# EAGLE board e-ink-display-v020 (EAGLE 7.3.0)
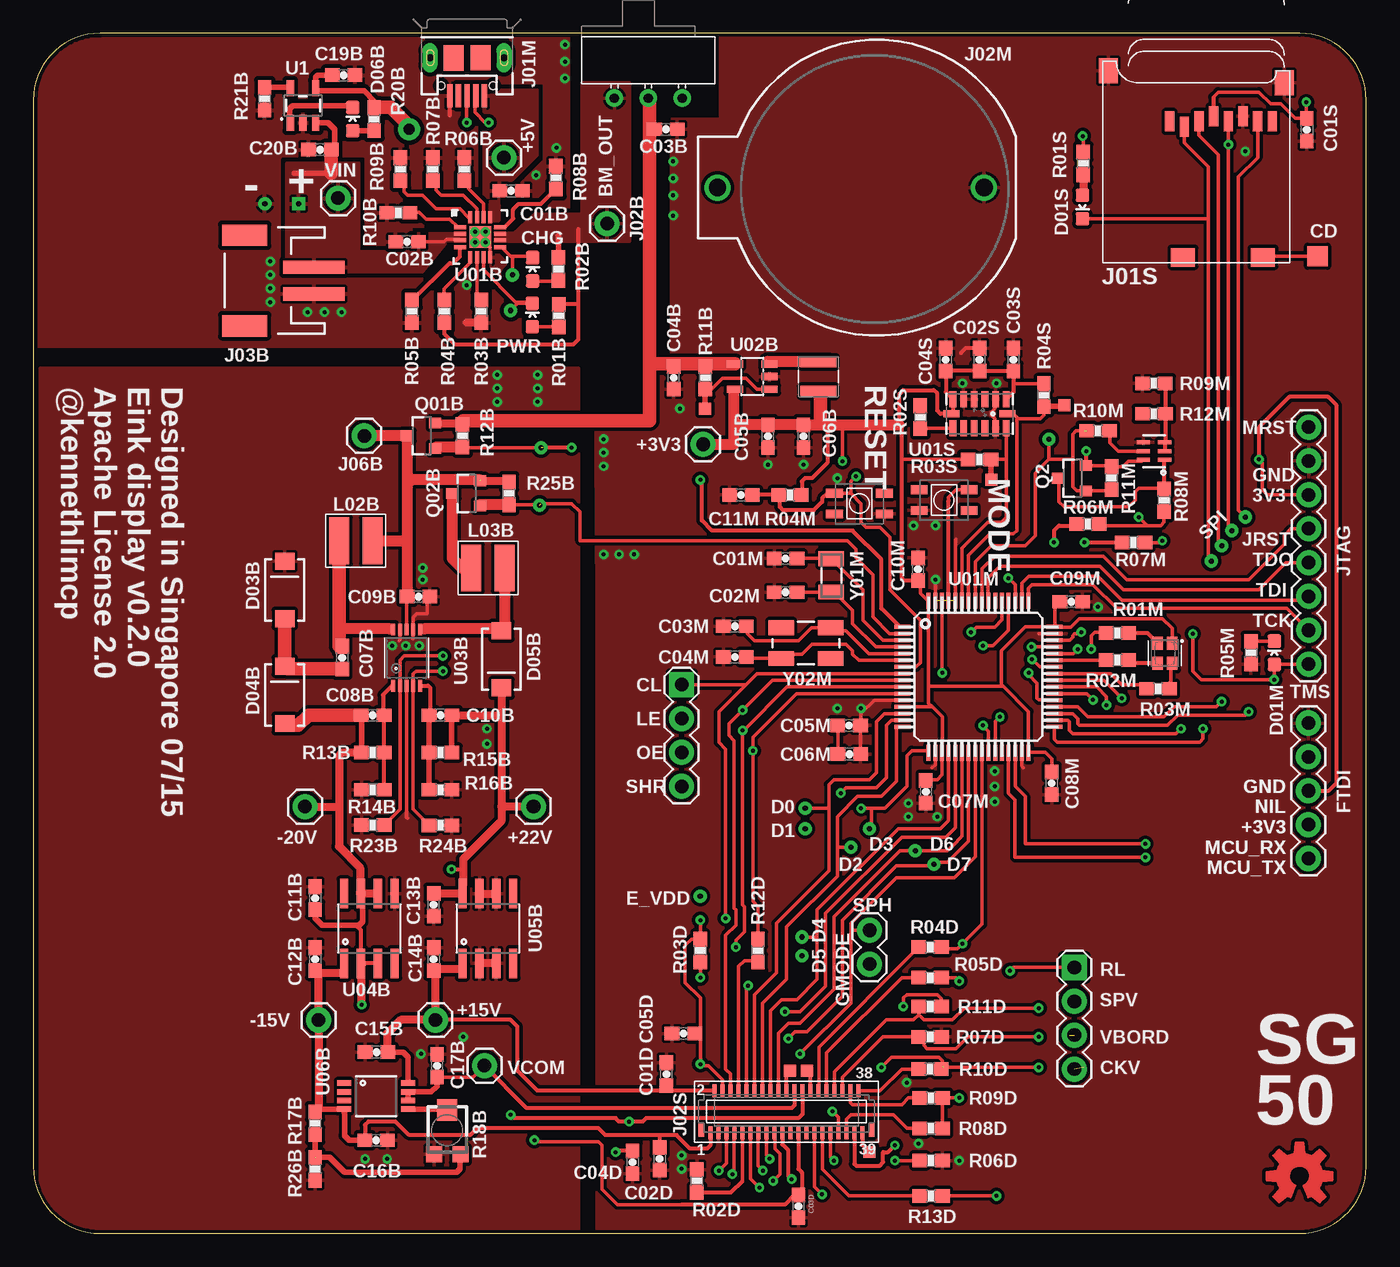
[diagram p4: board, top side]
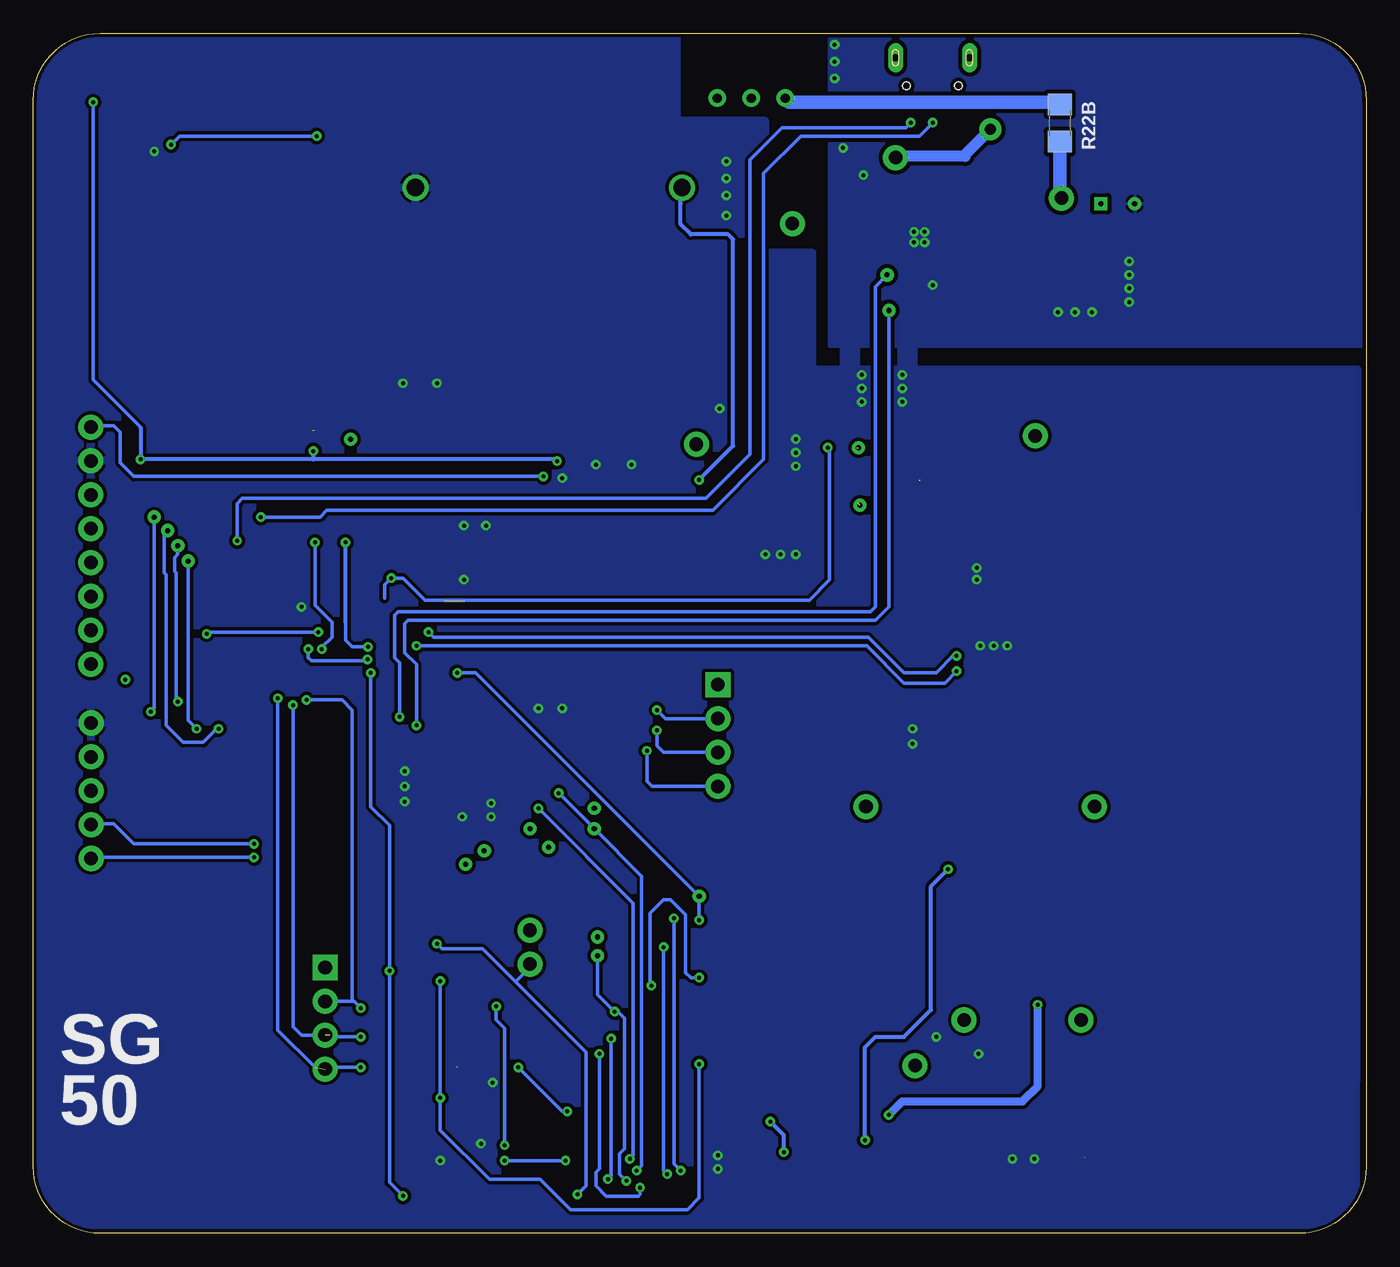
[diagram p5: board, bottom side, seen from below]

Size 100 x 90 mm. Coordinates in mm from the lower left corner, seen from the top.
Outline: 5,0 95,0 arc90 100,5 100,85 arc90 95,90 5,90 arc90 0,85 0,5 arc90 5,0
Copper layers (1+2*15+16): Top 0.018mm / dielectric 0.195mm / Route2 0.035mm / dielectric 1.1mm / Route15 0.035mm / dielectric 0.195mm / Bottom 0.018mm
Design rules "spark-4layer": minimum track width 6mil, minimum drill 0.3mm, track to track 6mil, track to pad 6mil, pad to pad 6mil, via to via 6mil, smd to smd 6mil, copper to edge 6mil, drill to drill 6mil, minimum pad ring 12mil, minimum via ring 8mil, stop-mask expansion 4mil, vias tented up to drill 20mil, thermal gap 8mil
Net classes: 0 default: clearance 0.205 mm

## Footprints (pad centres in the part's own frame; a part is rotated, then mirrored left to right if it is on the bottom)
TP-SQ_15TH = drill 0.381 pad 0.61 square: P$1 0,0
TP-RD_15TH = drill 0.381 pad 0.61: P$1 0,0
0603-CAP = smd 1.1 x 1: 1 -0.85,0; 2 0.85,0
LED-0603 = smd 1 x 1: A 0,-0.877; C 0,0.877
PLCC4-2MM-RGB = smd 1 x 0.8: BLUE -0.75,-0.55; CA 0.75,-0.55; GREEN -0.75,0.55; RED 0.75,0.55
SMA-DIODE = smd 1.27 x 1.47: A -2.15,0; C 2.15,0
1X01 = drill 1.016 pad 1.88: 1 0,0
USB-MICROB-SLOT-HOLE-EXTEND = smd 0.4 x 1.7: D+ 0,2.85; D- -0.65,2.85; GND 1.3,2.85; ID 0.65,2.85; VBUS -1.3,2.85 | drill 0.5 pad 1.1 long: MT1 -2.775,0; MT2 2.775,0 | smd 1.5 x 1.9: P$1 -1,0; P$2 1,0.01 | hole 0.6: -1.95,2.1; 1.95,2.1
MICROSD = smd 0.7 x 1.5: 1 9,-10.64; 2 7.9,-10.24; 3 6.8,-10.64; 4 5.7,-11.04; 5 4.6,-10.64; 6 3.5,-11.04; 7 2.4,-10.64; 8 1.3,-10.64 | smd 1.8 x 1.4: CD1 2,-0.44; CD2 8,-0.44 | smd 1.4 x 1.9: MT1 0.4,-13.54; MT2 13.6,-14.44
BATTCOM_20MM_PTH = drill 1.3: 1 11.85,0; 2 -8.15,0
FPC-0.3-39 = smd 0.3 x 1: 1 -1.2,-1.45; 2 -0.89,1.7; 3 -0.6,-1.45; 4 -0.29,1.7; 5 0,-1.45; 6 0.31,1.7; 7 0.6,-1.45; 8 0.91,1.7; 9 1.2,-1.45; 10 1.51,1.7; 11 1.8,-1.45; 12 2.11,1.7; 13 2.4,-1.45; 14 2.71,1.7; 15 3,-1.45; 16 3.31,1.7; 17 3.6,-1.45; 18 3.91,1.7; 19 4.2,-1.45; 20 4.51,1.7; 21 4.8,-1.45; 22 5.11,1.7; 23 5.4,-1.45; 24 5.71,1.7; 25 6,-1.45; 26 6.31,1.7; 27 6.6,-1.45; 28 6.91,1.7; 29 7.2,-1.45; 30 7.51,1.7; 31 7.8,-1.45; 32 8.11,1.7; 33 8.4,-1.45; 34 8.71,1.7; 35 9,-1.45; 36 9.31,1.7; 37 9.6,-1.45; 38 9.91,1.7; 39 10.2,-1.45 | smd 0.4 x 1: H1 -1.9,-1.25; H2 10.9,-1.25
JST-2-SMD = smd 1 x 4.6: 1 -1,-3.7; 2 1,-3.7 | smd 1.6 x 3.4: NC1 -3.4,1.5; NC2 3.4,1.5
1X08_ROUND = drill 1.016 pad 1.88: 1 0,0; 2 2.54,0; 3 5.08,0; 4 7.62,0; 5 10.16,0; 6 12.7,0; 7 15.24,0; 8 17.78,0
1X05 = drill 1.016 pad 1.88: 1 0,0; 2 2.54,0; 3 5.08,0; 4 7.62,0; 5 10.16,0
1X04 = drill 1.016 pad 1.88 square: 1 0,0 | drill 1.016 pad 1.88: 2 2.54,0; 3 5.08,0; 4 7.62,0
1X02 = drill 1.016 pad 1.88: 1 0,0; 2 2.54,0
INDUCTOR-NR3015 = smd 0.8 x 2.7: 1 -1.1,0; 2 1.1,0
4040(1515) = smd 1.5 x 3.5: P$1 1.25,0; P$2 -1.25,0
SOT23-3 = smd 0.8 x 0.9: 1 -0.95,-1; 2 0.95,-1; 3 0,1.1
SOT363 = smd 0.3 x 0.99: 1 -0.65,-0.8; 2 0,-0.8; 3 0.65,-0.8; 4 0.65,0.81; 5 0,0.81; 6 -0.65,0.81
0603-RES = smd 1.1 x 1: 1 -0.85,0; 2 0.85,0
TC33X = smd 1.2 x 1.2: 1 -1,-1.825; 3 1,-1.825 | smd 1.5 x 1.6: 2 0,1.5
1206 = smd 1.6 x 1.8: 1 -1.4,0; 2 1.4,0
TACTILE_SWITCH_SMD = smd 1.25 x 0.65: 1 -1.875,0.775; 2 1.875,0.775; 3 -1.875,-0.775; 4 1.875,-0.775
SW-SPDT-TH = drill 0.7: 1 0,0; 2 -2.54,0; 3 2.54,0
TP35_BOT = smd 0.889 x 0.889 bottom: P$1 0,0
TP_15TH = drill 0.381 pad 0.61: P$1 0,0
SOT23-5 = smd 0.55 x 1.2: 1 -0.95,-1.3; 2 0,-1.3; 3 0.95,-1.3; 4 0.95,1.3; 5 -0.95,1.3
PVQFN-16 = smd 0.9 x 0.3: 1 -1.5,0.75; 2 -1.5,0.25; 3 -1.5,-0.25; 4 -1.5,-0.75; 9 1.5,-0.75; 10 1.5,-0.25; 11 1.5,0.25; 12 1.5,0.75 | smd 0.3 x 0.9: 5 -0.75,-1.5; 6 -0.25,-1.5; 7 0.25,-1.5; 8 0.75,-1.5; 13 0.75,1.5; 14 0.25,1.5; 15 -0.25,1.5; 16 -0.75,1.5 | smd 1.6 x 1.6: EXP 0,0
TQFP64 = smd 1.2 x 0.3: 1 -5.7,3.75; 2 -5.7,3.25; 3 -5.7,2.75; 4 -5.7,2.25; 5 -5.7,1.75; 6 -5.7,1.25; 7 -5.7,0.75; 8 -5.7,0.25; 9 -5.7,-0.25; 10 -5.7,-0.75; 11 -5.7,-1.25; 12 -5.7,-1.75; 13 -5.7,-2.25; 14 -5.7,-2.75; 15 -5.7,-3.25; 16 -5.7,-3.75; 33 5.7,-3.75; 34 5.7,-3.25; 35 5.7,-2.75; 36 5.7,-2.25; 37 5.7,-1.75; 38 5.7,-1.25; 39 5.7,-0.75; 40 5.7,-0.25; 41 5.7,0.25; 42 5.7,0.75; 43 5.7,1.25; 44 5.7,1.75; 45 5.7,2.25; 46 5.7,2.75; 47 5.7,3.25; 48 5.7,3.75 | smd 0.3 x 1.2: 17 -3.75,-5.7; 18 -3.25,-5.7; 19 -2.75,-5.7; 20 -2.25,-5.7; 21 -1.75,-5.7; 22 -1.25,-5.7; 23 -0.75,-5.7; 24 -0.25,-5.7; 25 0.25,-5.7; 26 0.75,-5.7; 27 1.25,-5.7; 28 1.75,-5.7; 29 2.25,-5.7; 30 2.75,-5.7; 31 3.25,-5.7; 32 3.75,-5.7; 49 3.75,5.7; 50 3.25,5.7; 51 2.75,5.7; 52 2.25,5.7; 53 1.75,5.7; 54 1.25,5.7; 55 0.75,5.7; 56 0.25,5.7; 57 -0.25,5.7; 58 -0.75,5.7; 59 -1.25,5.7; 60 -1.75,5.7; 61 -2.25,5.7; 62 -2.75,5.7; 63 -3.25,5.7; 64 -3.75,5.7
LGA14 = smd 0.5 x 1.2: 1 2,1.1; 2 1.2,1.1; 3 0.4,1.1; 4 -0.4,1.1; 5 -1.2,1.1; 6 -2,1.1; 8 -2,-1.1; 9 -1.2,-1.1; 10 -0.4,-1.1; 11 0.4,-1.1; 12 1.2,-1.1; 13 2,-1.1 | smd 1.2 x 0.5: 7 -2.1,0; 14 2.1,0
MSOP-10 = smd 0.305 x 0.889: 1 -1,-2.11; 2 -0.5,-2.11; 3 0,-2.11; 4 0.5,-2.11; 5 1,-2.11; 6 1,2.11; 7 0.5,2.11; 8 0,2.11; 9 -0.5,2.11; 10 -1,2.11
SO08 = smd 0.61 x 2.21: 1 -1.905,-2.616; 2 -0.635,-2.616; 3 0.635,-2.616; 4 1.905,-2.616; 5 1.905,2.616; 6 0.635,2.616; 7 -0.635,2.616; 8 -1.905,2.616
MSOP-8 = smd 0.41 x 1.02: 1 -0.975,-2.4; 2 -0.325,-2.4; 3 0.325,-2.4; 4 0.975,-2.4; 5 0.975,2.4; 6 0.325,2.4; 7 -0.325,2.4; 8 -0.975,2.4
TP60_BOT = smd 1.524 x 1.524 bottom: P$1 0,0
FC135 = smd 1.1 x 1.9: X1 -1.25,0; X2 1.25,0
CRYSTAL-SMD-5X3 = smd 1.9 x 1.1: 1 -1.85,-1.15; 2 1.85,-1.15; 3 1.85,1.15; 4 -1.85,1.15

## Placement (x,y rotation side)
BAT+  [TP-SQ_15TH]  19.91,77.22 0 top
BAT-  [TP-RD_15TH]  17.37,77.22 0 top
C01B  1uF, 25V, 10%  [0603-CAP]  35.84,78.19 180 top
C01D  100nF  [0603-CAP]  47.5,11.94 90 top
C01M  10pF, 6.3V, X5R  [0603-CAP]  56.44,50.62 180 top
C01S  0.1uF, 6.3V, X5R  [0603-CAP]  95.54,82.76 270 top
C02B  4.7uF, 25V, X5R  [0603-CAP]  28.04,74.37 0 top
C02D  100nF  [0603-CAP]  46.99,5.59 270 top
C02M  10pF, 6.3V, X5R  [0603-CAP]  56.44,48.08 180 top
C02S  10uF, 6.3V, X5R  [0603-CAP]  70.99,65.53 90 top
C03B  4.7uF, 25V, X5R  [0603-CAP]  47.46,82.8 180 top
C03D  100nF  [0603-CAP]  57.4,2.03 270 top
C03M  22pf, 6.3V, X5R  [0603-CAP]  52.63,45.54 180 top
C03S  0.1uF, 6.3V, X5R  [0603-CAP]  73.53,65.53 90 top
C04B  4.7uF, 25V, X5R  [0603-CAP]  48.04,64.17 90 top
C04D  100nF  [0603-CAP]  44.96,5.33 270 top
C04M  22pf, 6.3V, X5R  [0603-CAP]  52.63,43.23 180 top
C04S  0.1uF, 6.3V, X5R  [0603-CAP]  68.45,65.53 90 top
C05B  22uF, 25V, X5R  [0603-CAP]  55.12,59.78 90 top
C05D  100nF  [0603-CAP]  48.77,14.99 180 top
C05M  10nF, 6.3V, X5R  [0603-CAP]  61.21,38.09 0 top
C06B  0.1uF, 25V, X5R  [0603-CAP]  57.78,59.78 90 top
C06M  1.0uF, 6.3V, X5R  [0603-CAP]  61.21,35.94 0 top
C07B  0.1uF, 50V, X5R  [0603-CAP]  23.18,43.18 270 top
C07M  100nF, 6.3V, X5R  [0603-CAP]  66.96,33.12 270 top
C08B  100pf, 50V, X5R  [0603-CAP]  25.47,38.86 180 top
C08M  100nF, 6.3V, X5R  [0603-CAP]  76.4,33.76 270 top
C09B  4.7uF, 50V, X5R  [0603-CAP]  28.89,47.75 180 top
C09M  100nF, 6.3V, X5R  [0603-CAP]  77.87,47.37 0 top
C10B  4.7pf, 50V, X5R  [0603-CAP]  30.55,38.86 0 top
C10M  100nF, 6.3V, X5R  [0603-CAP]  66.38,49.81 90 top
C11B  1uF, 50V, X5R  [0603-CAP]  21.15,25.15 270 top
C11M  100nF, 6.3V, X5R  [0603-CAP]  53.09,55.38 180 top
C12B  0.1uF, 50V, X5R  [0603-CAP]  21.15,20.57 270 top
C13B  1uF, 50V, X5R  [0603-CAP]  30.04,24.64 90 top
C14B  0.1uF, 50V, X5R  [0603-CAP]  30.04,20.57 270 top
C15B  0.1uF, 25V, X5R  [0603-CAP]  25.75,13.59 0 top
C16B  0.1uF, 25V, X5R  [0603-CAP]  25.72,6.99 180 top
C17B  0.1uF, 25V, X5R  [0603-CAP]  30.29,12.57 270 top
C19B  4.7uF (DNP)  [0603-CAP]  23.28,86.87 180 top
C20B  4.7uF (DNP)  [0603-CAP]  21.5,81.28 0 top
D01B  Green  [LED-0603]  37.44,68.87 0 top
D01M  BLUE  [LED-0603]  93.11,43.54 0 top
D01S  Red  [LED-0603]  78.72,76.98 180 top
D02B  Red  [LED-0603]  37.47,72.3 0 top
D02M  RGB-LED-CLMVB-FKARGB  [PLCC4-2MM-RGB]  84.89,43.51 90 top
D03B  SS24T3G  [SMA-DIODE]  18.86,48.26 90 top
D04B  SS24T3G  [SMA-DIODE]  18.86,40.39 90 top
D05B  SS24T3G  [SMA-DIODE]  35.12,43.05 270 top
D06B  Red (DNP)  [LED-0603]  23.97,83.57 0 top
J01B  [1X01]  35.31,80.68 270 top
J01M  USBUSB-MICROB-PAD-EXTEND  [USB-MICROB-SLOT-HOLE-EXTEND]  32.54,88.17 180 top
J01S  MICROSD  [MICROSD]  94.25,72.75 180 top
J02B  [1X01]  43.05,75.73 270 top
J02M  [BATTCOM_20MM_PTH]  63.19,78.43 180 top
J02S  EINKED060SC4  [FPC-0.3-39]  52,9 0 top
J03B  [JST-2-SMD]  17.36,71.46 90 top
J04B  [1X01]  22.86,77.63 270 top
J05B  [1X01]  50.26,59.18 0 top
J06B  [1X01]  24.83,59.82 270 top
J07B  [1X01]  20.39,32 270 top
J08B  [1X01]  37.53,32 270 top
J09B  [1X01]  21.4,16 270 top
J10B  [1X01]  30.16,16 270 top
J11B  [1X01]  33.85,12.57 0 top
JP1  [1X08_ROUND]  95.68,60.47 270 top
JP2  [1X05]  95.66,38.27 270 top
JP4  [1X04]  48.64,41.15 270 top
JP5  [1X02]  62.74,22.73 270 top
JP6  [1X04]  78.11,19.94 270 top
L01B  2.2uH - NR3015T2R2M  [INDUCTOR-NR3015]  58.89,64.26 270 top
L02B  22uH  [4040(1515)]  24.2,51.94 0 top
L03B  22uH  [4040(1515)]  34.1,49.91 180 top
LOGO1  OSHW-LOGOPAD  [OSHW-LOGO-M-PAD]  95,4.29 0 top
Q01B  IRLML6402PbF  [SOT23-3]  29.15,59.82 90 top
Q2  IRLML6402PbF (DNP)  [SOT23-3]  77.98,56.64 90 top
Q02B  IRLML6402PbF  [SOT23-3]  32.52,55.49 90 top
Q02M  MMDT3904  [SOT363]  84.08,58.67 90 top
R01B  1K, 1%  [0603-RES]  39.42,68.82 270 top
R01M  1K, 1%  [0603-RES]  81.34,45.03 0 top
R01S  1K, 1%  [0603-RES]  78.77,80.25 90 top
R02B  1K, 1%  [0603-RES]  39.4,72.33 90 top
R02D  0 Ohm  [0603-RES]  49.78,3.94 90 top
R02M  1K, 1%  [0603-RES]  81.34,43 0 top
R02S  0 Ohm  [0603-RES]  66.55,61.21 270 top
R03B  0 Ohm  [0603-RES]  33.6,69.15 270 top
R03D  0 Ohm  [0603-RES]  50.04,21.21 270 top
R03M  1K, 1%  [0603-RES]  84.38,40.84 0 top
R03S  4.7K, 1%  [0603-RES]  70.99,58.04 180 top
R04B  0 Ohm  [0603-RES]  30.84,69.15 270 top
R04D  0 Ohm  [0603-RES]  67.29,21.46 180 top
R04M  10K, 1%  [0603-RES]  56.77,55.38 0 top
R04S  4.7K, 1%  [0603-RES]  75.82,62.87 90 top
R05B  0 Ohm  [0603-RES]  28.41,69.15 90 top
R05D  0 Ohm  [0603-RES]  67.29,19.18 180 top
R05M  1K, 1%  [0603-RES]  91.36,43.54 270 top
R06B  0 ohm (DNP)  [0603-RES]  32.33,79.81 270 top
R06D  0 Ohm  [0603-RES]  67.36,5.46 180 top
R06M  22, 1%  [0603-RES]  79.12,53.21 0 top
R07B  0 Ohm  [0603-RES]  29.98,79.81 270 top
R07D  0 Ohm  [0603-RES]  67.29,14.73 0 top
R07M  22, 1%  [0603-RES]  82.55,51.81 0 top
R08B  2K, 1%  [0603-RES]  39.21,79.18 270 top
R08D  0 Ohm  [0603-RES]  67.36,7.87 180 top
R08M  1K5  [0603-RES]  84.84,54.99 90 top
R09B  1K, 1%  [0603-RES]  27.55,79.81 270 top
R09D  0 Ohm  [0603-RES]  67.36,10.16 180 top
R09M  1K, 1%  [0603-RES]  84.07,63.75 0 top
R10B  10K, 1%  [0603-RES]  27.39,76.55 0 top
R10D  0 Ohm  [0603-RES]  67.26,12.32 0 top
R10M  1K, 1%  [0603-RES]  79.88,60.19 0 top
R11B  100K, 1%  [0603-RES]  50.42,64.17 90 top
R11D  0 Ohm  [0603-RES]  67.29,17.02 180 top
R11M  47K, 1%  [0603-RES]  80.89,56.65 270 top
R12B  10K, 1%  [0603-RES]  32.2,59.82 90 top
R12D  0 Ohm  [0603-RES]  54.36,21.2 90 top
R12M  10K, 1%  [0603-RES]  84.08,61.48 180 top
R13B  470K, 1%  [0603-RES]  25.47,36.07 180 top
R13D  0 Ohm  [0603-RES]  67.36,2.8 180 top
R14B  33K, 1%  [0603-RES]  25.47,33.27 0 top
R15B  560K, 1%  [0603-RES]  30.55,36.07 0 top
R16B  33K, 1%  [0603-RES]  30.55,33.27 180 top
R17B  200K, 1%  [0603-RES]  21.15,8.26 90 top
R18B  100K, 25%  [TC33X]  31.05,7.75 0 top
R20B  1K (DNP)  [0603-RES]  25.56,83.57 270 top
R21B  2K (DNP)  [0603-RES]  17.36,85.09 90 top
R22B  0 ohm (DNP)  [1206]  22.99,83.28 90 bottom
R23B  0 Ohm  [0603-RES]  25.47,30.61 180 top
R24B  0 Ohm  [0603-RES]  30.55,30.6 0 top
R25B  10K, 1%  [0603-RES]  35.69,55.49 90 top
R26B  DNP  [0603-RES]  21.15,4.83 90 top
S01M  [TACTILE_SWITCH_SMD]  68.33,54.99 180 top
S02M  [TACTILE_SWITCH_SMD]  61.98,54.74 0 top
SW01M  SWITCHSIDE-SLIDE  [SW-SPDT-TH]  46.14,85.14 0 top
TP1  [TP-RD_15TH]  38.1,58.93 0 top
TP01B  TP1  [TP35_BOT]  50.38,61.85 0 bottom
TP01M  [TP-RD_15TH]  50.04,25.27 0 top
TP1M  [TP-RD_15TH]  61.34,28.96 0 top
TP2  [TP-RD_15TH]  37.97,54.61 0 top
TP02M  [TP-RD_15TH]  89.15,51.56 0 top
TP03M  TEST-POINTTP_15TH_THRU  [TP_15TH]  90.93,53.72 0 top
TP04M  [TP-RD_15TH]  89.92,52.7 0 top
TP05M  [TP-RD_15TH]  88.39,50.42 0 top
TP06M  [TP-RD_15TH]  76.2,59.56 0 top
TP07M  [TP-RD_15TH]  35.81,69.22 0 top
TP08M  [TP-RD_15TH]  35.94,71.88 0 top
TP09M  [TP-RD_15TH]  57.91,31.88 0 top
TP10M  [TP-RD_15TH]  57.91,30.35 0 top
TP12M  [TP-RD_15TH]  62.74,30.35 0 top
TP13M  [TP-RD_15TH]  57.66,22.23 0 top
TP14M  [TP-RD_15TH]  57.66,20.83 0 top
TP15M  [TP-RD_15TH]  66.17,28.7 0 top
TP16M  [TP-RD_15TH]  67.56,27.69 0 top
TP17M  TP1  [TP35_BOT]  71.88,56.52 0 bottom
TP18M  TP1  [TP35_BOT]  77.34,62.1 0 bottom
U1  MCP73831  [SOT23-5]  20.23,84.58 0 top
U01B  BQ24075  [PVQFN-16]  33.53,74.71 0 top
U01M  STM32F10XRXT6  [TQFP64]  70.92,41.73 0 top
U01S  ADXL345  [LGA14]  70.99,61.47 0 top
U02B  R8008-33  [SOT23-5]  53.94,64.26 90 top
U03B  LT1945-IMS#PBF  [MSOP-10]  28.01,43.18 0 top
U04B  LM79L15  [SO08]  25.21,22.86 0 top
U05B  LM78L15  [SO08]  34.1,22.86 0 top
U06B  LM358-DGKR  [MSOP-8]  25.72,10.29 270 top
U$1  TP1  [TP35_BOT]  56.77,12.19 0 bottom
U$5  TP3  [TP60_BOT]  96.35,73.28 90 bottom
U$8  TP1  [TP35_BOT]  58.04,12.19 0 bottom
U$9  TP1  [TP35_BOT]  62.74,6.1 0 bottom
Y01M  32kHz  [FC135]  59.87,49.35 90 top
Y02M  8MHz  [CRYSTAL-SMD-5X3]  57.97,44.27 0 top

## Tracks (layer width: path | path; a pad name or v marks a point on that pad's centre or on a via)
!MCU_RST  (via drill 0.3)
  Top 0.254: U01M.7 66.23,42.48 66.55,42.8 66.55,45.97 64.26,48.26 64.26,52.2 63.5,52.96 62.48,52.96 62.1,53.34 62.1,54.74 61.34,55.5 | 61.34,55.5 60.11,55.5 S02M.1 | 61.34,55.5 61.34,56.39 v61.72,56.77
  Top 0.305: S02M.1 59.58,55.51 59.18,55.12 59.18,54.86 58.55,54.23 56.26,54.23 56.01,54.48 56.01,55.3 R04M.1 C11M.1 53.81,55.38
  Bottom 0.254: v61.72,56.77 92.46,56.77 93.47,57.78 93.47,60.07 93.98,60.58 95.57,60.58 JP1.1
+3V3  (via drill 0.3)
  Top 0.254: C10M.1 66.55,48.78 66.55,48.01 67.13,47.43 U01M.64 67.17,41.15 | U01M.13 67.46,39.48 | 67.46,39.48 68.2,38.73 68.2,36.05 U01M.19 68.17,34.39 67.82,34.04 67.02,34.04 C07M.1 67.02,34.04 | C08M.1 76.4,35.61 75.95,36.07 74.71,36.07 U01M.32 74.67,39.12 72.77,41.02 | D02M.CA 85.44,45.37 84.71,46.1 78.49,46.1 77.85,45.47 76.63,45.47 | 76.63,45.47 U01M.48 74.43,45.48 72.64,43.69 72.64,41.15 72.77,41.02 | 76.63,45.47 76.63,46.98 C09M.1 | Q2.2 80.8,57.59 R11M.1 81.75,57.5 82.17,57.91 83.16,57.91 Q02M.6 | 67.17,41.15 67.17,39.76 67.46,39.48 | 67.17,41.15 67.3,41.02 72.77,41.02 | C01S.1 95.42,83.61 | 88.55,85.25 88.52,85.22 88.52,83.83 J01S.4 88.55,85.25 | JP1.3 92.56,55.39 92.2,55.75 92.2,57.78 v91.95,58.04 | v60.71,57.91 60.71,60.63 | 88.55,85.25 88.9,85.6 91.95,85.6 92.84,84.71 93.6,84.71 94.69,83.61 95.42,83.61 | 95.42,83.61 95.5,83.69 v95.5,84.84 | 59.56,60.58 59.05,60.58 59.05,60.63 | R03S.2 65.15,58.04 | R04S.2 73.57,63.72 73.53,63.75
  Top 0.305: U01S.1 73.53,63.11 73.53,63.75 C03S.1 C02S.1 C04S.1 68.45,63.11 U01S.6 68.99,61.57 U01S.7 68.07,61.47 67.82,61.72 67.82,62.99 67.56,63.25 65.28,63.25 64.97,62.94 64.97,60.63 65.15,60.45 65.15,58.04 65.15,49.15 65.34,48.96 C10M.1 | 52.58,63.12 52.64,63.12 U02B.5 | 59.05,63 58.89,63 L01B.2 | v78.99,58.67 v78.98,58.66 Q2.2 | JP2.3 97.2,33.19 97.79,33.78 97.79,62.1 97.16,62.74 94.23,62.74 91.95,60.45 v91.95,58.04 | 59.56,60.58 59.56,57.78 58.42,56.64 57.91,56.64 57.66,56.39 57.66,55.41 R04M.2
  Top 0.406: 59.05,60.63 59.05,61.09 | 59.82,60.63 59.56,60.63 59.56,60.58
  Top 0.813: 52.58,60.63 C05B.2 C06B.2 59.05,60.63 59.82,60.63 60.71,60.63 64.97,60.63 | 52.58,60.63 52.58,63.12 | J05B.1 52.58,59.18 52.58,60.63
  Top 1.016: 59.05,63 59.05,61.09
  Bottom 0.254: 60.83,58.04 v60.71,57.91 | v95.5,84.84 95.5,64.01 91.95,60.45
  Bottom 0.305: 60.83,58.04 78.99,58.04 | 78.99,58.04 v91.95,58.04 91.95,60.45 | v78.99,58.67 78.99,58.04
+15V
  Top 0.254: C01D.1 47.5,10.7
  Top 0.305: J02S.2 47.5,10.7 37.81,10.7 36.32,12.19 36.32,15.49 35.81,16 J10B.1
  Top 0.406: U06B.8 28.12,13.22 27.75,13.59 C15B.2
  Top 0.61: U05B.1 32.2,19.94 32.07,19.81 30.13,19.81 C14B.2 30.16,19.72 J10B.1 27.56,16 26.54,14.99 26.54,13.64 C15B.2
+22V  (via drill 0.3)
  Top 0.254: 37.72,7.11 v37.59,6.99 37.72,6.86 42.42,6.86 42.67,6.6 42.67,3.3 43.81,2.16 48.64,2.16
  Top 0.305: J02S.23 57.4,4.83 57.66,4.57 57.66,3.14 C03D.1 57.11,2.88 56.39,2.16 48.64,2.16 | v31.37,27.3 32.26,27.3 | 32.26,26.16 32.26,25.54 U05B.8
  Top 0.406: R15B.2 C10B.2
  Top 0.61: D05B.C 35.12,38.86 | 35.12,38.86 35.12,32 | C10B.2 35.12,38.86 | J08B.1 35.12,32 | C13B.2 32.19,25.49 U05B.8 | 35.12,32 35.12,30.93 32.26,28.07 32.26,27.3 32.26,26.16
  Bottom 0.305: v37.59,6.99 37.59,13.97 36.83,14.73 34.67,14.73 32.64,16.76 32.64,26.04 v31.37,27.3
-15V
  Top 0.305: 23.18,19.56 23.18,20.12 U04B.1 | J02S.1 50.8,6.6 50.55,6.35 49.28,6.35 48.26,7.37 46.99,7.37 | C16B.2 24.89,7.01 24.89,8.13 25.15,8.38 27.18,8.38 28.19,7.37 32.77,7.37 33.27,7.87 42.42,7.87 42.93,7.37 46.99,7.37 | 46.99,7.37 C02D.1
  Top 0.406: C16B.2 23.69,6.99 23.35,7.33 23.35,9.06 23.32,9.08 U06B.4 21.36,9.31 R17B.2
  Top 0.61: 23.18,19.56 21.15,19.56 C12B.2 21.4,19.72 J09B.1 21.4,9.36 R17B.2
-20V  (via drill 0.3)
  Top 0.305: U04B.3 U04B.2 | U04B.2 24.58,22.73 24.2,23.11 | J02S.24 57.71,8.94 57.4,8.64 45.97,8.64 45.72,8.38 v44.7,8.38 43.94,8.38 43.69,8.64 36.07,8.64 v35.81,8.89 | 24.64,20.18 U04B.2 | C04D.1 43.78,6.18 v43.69,6.1
  Top 0.406: R13B.2 C08B.2 | C11B.2 21.15,23.62 21.66,23.11 24.2,23.11 24.45,23.11 24.7,23.37 24.7,25.35 U04B.7
  Top 0.61: U04B.6 U04B.7 24.51,25.54 24.51,27.43 22.93,29.02 22.93,32 | R13B.2 23.18,36.07 22.93,35.81 22.93,32 | J07B.1 22.93,32 | v24.64,17.14 24.64,20.18
  Top 1.016: C08B.2 20.64,38.86 19.88,38.1 19,38.1 D04B.A
  Bottom 0.305: v43.69,6.1 43.69,7.37 v44.7,8.38
  Bottom 0.61: v35.81,8.89 34.8,9.91 25.78,9.91 24.64,11.05 v24.64,17.14
BM_BAT
  Top 0.254: C02B.2 30.81,74.37 30.99,74.55 31.94,74.55 U01B.3
  Top 0.406: 22.35,79.5 19.56,79.5 | U1.3 22.13,83.28 22.61,82.8 22.61,81.54 C20B.2
  Top 1.016: C20B.2 22.35,80.01 22.35,79.5
  Bottom 1.016: 22.95,77.8 J04B.1 22.99,77.76 R22B.1
  pour Top (isolate 0.254): 30.91,74.98 28.5,74.98 28.47,73.61 19.02,73.63 19.02,72.14 29.21,72.14 30.91,74.19
  pour Top (no thermals): 32.36,74.98 30.96,74.98 30.96,74.45 32.36,74.45
  pour Top: 24.38,72.14 19.05,72.14 19.05,80.26 24.38,80.26
BM_CE
  Top 0.254: U01B.4 32,73.94
  Top 0.305: R05B.2 28.47,70 31.24,72.77 31.5,72.77 32,73.28 32,73.94
BM_CHG  (via drill 0.3)
  Top 0.254: U01B.9 35.13,73.96 35.81,73.28 36.07,73.28 | 36.07,73.28 37.36,73.28 D02B.C | TP08M.P$1 35.94,73.15 36.07,73.28 | U01M.27 72.17,38.39 v72.52,38.73
  Bottom 0.254: TP08M.P$1 36.83,70.99 36.83,46.99 37.21,46.61 72.64,46.61 72.9,46.35 72.9,43.18 72.52,42.8 v72.52,38.73
BM_OUT
  Top 0.305: 40.89,69.67 40.89,67.06 40.51,66.67 31.62,66.67 30.84,67.46 R04B.2 | 40.89,69.67 40.89,75.31 | 40.89,69.67 R01B.1
  Top 0.406: R02B.2 39.4,74.78 39.37,74.8
  Bottom 1.016: 22.99,84.96 R22B.2 23.15,84.84 43.3,84.84 SW01M.2
  pour Top (isolate 0.254): 41.16,86.3 44.73,86.3 44.73,74.4 36,74.4 36,74.95 37.6,76.45 41.16,76.45
  pour Top (no thermals): 34.7,75 36.1,75 36.1,74.4 34.7,74.4
BM_PGOOD  (via drill 0.3)
  Top 0.254: U01B.7 33.78,72.27 36.2,69.85 37.34,69.85 D01B.C 36.35,69.75 TP07M.P$1 | U01M.26 71.67,37.67 v71.25,38.1
  Bottom 0.254: v71.25,38.1 71.25,42.67 72.14,43.56 72.14,45.72 71.88,45.97 36.83,45.97 35.81,46.99 TP07M.P$1
BM_SUPPLY
  Top 0.254: C03B.2 46.48,82.8 46.23,83.06
  Top 0.305: 52.71,65.28 U02B.4 | C04B.2 47.37,65.02 47.37,65.21 | R11B.2 49.66,65.02 49.66,65.21
  Top 0.61: Q01B.2 32.1,60.77 R12B.2
  Top 1.016: U02B.4 49.66,65.21 47.37,65.21 46.42,65.21 46.23,65.02 | SW01M.1 46.23,85.26 46.23,83.06 46.23,65.02 | 46.23,65.02 46.23,60.96 32.24,60.96 R12B.2
BM_SYSOFF
  Top 0.254: U01B.15 33.28,76.83 32.26,77.85 30.61,77.85 30.23,78.23 30.23,78.72 R07B.2
CE2  (via drill 0.3)
  Top 0.254: v50.04,19.18 R03D.2 | J02S.10 53.51,18.46 v53.64,18.59
  Bottom 0.254: 53.51,18.46 v53.64,18.59 53.72,18.67 53.72,24 52.7,25.02 52.2,25.02 51.05,23.88 51.05,19.56 50.67,19.18 v50.04,19.18
D+_CTRL
  Top 0.254: Q2.3 76.96,56.56 76.96,54.86 77.34,54.48 82.17,54.48 82.68,54.99 82.68,55.63 82.94,55.89 84.79,55.89 R08M.2
  Top 0.305: R08M.2 84.84,57.98 Q02M.1
EINK_CKV  (via drill 0.3)  (2 unrouted)
  Top 0.254: U01M.40 80.32,41.48 v81.66,40.13 | J02S.33 60.4,8.69 v59.94,9.14 | v63.63,12.45 64.39,13.21 67.94,13.21 68.2,12.95 68.2,12.53 | v75.44,12.45 68.24,12.45 R10D.2
  Bottom 0.254: v81.66,40.13 81.66,15.24 78.87,12.45 v75.44,12.45 | v59.94,9.14 60.33,9.14 v63.63,12.45
EINK_CL  (via drill 0.3)
  Top 0.254: U01M.8 54.3,41.98 53.47,41.15 | J02S.5 52,5.26 v51.44,4.7 | v51.94,23.62 51.94,36.32 51.44,36.83 51.44,39.12 53.47,41.15 | JP4.1 53.47,41.15
  Bottom 0.254: v51.94,23.62 51.94,5.21 v51.44,4.7
EINK_D0
  Top 0.254: U01M.14 63.87,38.98 63.25,38.35 63.25,34.54 62.74,34.04 60.07,34.04 59.69,33.66 59.69,31.75 | 59.69,31.75 59.69,27.18 55.75,23.24 55.75,19.56 54.1,17.91 J02S.12 | TP09M.P$1 59.56,31.88 59.69,31.75
EINK_D1  (via drill 0.3)
  Top 0.254: U01M.15 64.39,38.48 64.01,38.1 64.01,34.16 63.25,33.4 60.96,33.4 v60.58,33.02 | v54.74,4.7 54.36,5.08 54.36,7.51 J02S.13
  Bottom 0.254: v60.58,33.02 60.2,32.64 TP10M.P$1 54.36,26.8 54.36,5.08 v54.74,4.7
EINK_D2
  Top 0.254: J02S.14 54.71,17.25 56.52,19.05 56.52,22.99 60.33,26.8 60.33,28.96 | 60.33,28.96 60.33,31.24 61.85,32.77 63.64,32.77 64.77,33.89 64.77,37.97 64.77,37.98 U01M.16 | TP1M.P$1 60.33,28.96
EINK_D3  (via drill 0.3)
  Top 0.254: 62.87,31.88 63.88,31.88 65.53,33.53 65.53,35.81 65.91,36.2 67,36.2 U01M.17 | v55.24,5.59 54.99,5.84 J02S.15 | v62.1,31.88 62.87,31.88 | 62.87,31.88 62.87,30.48 TP12M.P$1
  Bottom 0.254: v62.1,31.88 54.99,24.77 54.99,5.84 v55.24,5.59
EINK_D4
  Top 0.254: U01M.20 68.67,30.95 68.07,30.35 64.9,30.35 58.8,24.26 58.8,22.35 58.8,22.23 | J02S.16 55.31,16.7 56.13,17.53 57.28,17.53 58.8,19.05 58.8,22.23 | TP13M.P$1 58.8,22.23
EINK_D5  (via drill 0.3)
  Top 0.254: v56.39,16.64 57.53,16.64 59.44,18.54 59.44,24 65.15,29.72 68.45,29.72 69.17,30.44 U01M.21 | v55.5,3.94 56.01,4.45 56.01,5.97 55.63,6.35 55.63,7.52 J02S.17
  Bottom 0.254: v55.5,3.94 56.01,4.45 56.01,5.97 55.63,6.35 55.63,16.13 56.13,16.64 v56.39,16.64 57.66,17.91 | 57.66,17.91 TP14M.P$1 57.66,17.91
EINK_D6
  Top 0.254: J02S.18 55.91,15.02 56.64,15.75 57.53,15.75 60.07,18.29 60.07,23.75 65.02,28.7 TP15M.P$1 | U01M.22 69.67,29.77 68.99,29.08 68.96,29.08 68.58,28.7 | 68.58,28.7 TP15M.P$1 | 68.58,28.7 TP15M.P$1
EINK_D7  (via drill 0.3)
  Top 0.254: U01M.23 70.17,29.41 68.58,27.81 67.69,27.81 TP16M.P$1 67.44,27.56 64.77,27.56 60.71,23.5 60.71,17.78 58.04,15.11 57.15,15.11 v56.64,14.61
  Top 0.305: v56.9,4.06 56.64,4.32 56.64,6.22 56.2,6.67 J02S.19
  Bottom 0.254: v56.64,14.61 56.64,4.32 v56.9,4.06
EINK_GMODE2  (via drill 0.3)
  Top 0.254: U01M.25 71.17,23.17 v69.72,21.72 69.34,21.34 68.26,21.34 R04D.1 | J02S.27 58.6,3.5 v59.18,2.92
  Bottom 0.254: v59.18,2.92 58.55,3.56 58.55,13.59 63.82,18.86 | 63.82,18.86 66.29,21.34 69.34,21.34 v69.72,21.72 69.79,21.78 | JP5.2 62.74,19.94 63.82,18.86
EINK_LE  (via drill 0.3)
  Top 0.254: U01M.9 55.45,41.48 v53.21,39.24 52.2,38.23 52.2,37.34 52.58,36.96 52.58,24.38 52.7,24.26 52.7,23.11 51.94,22.35 51.94,12.32 52.31,11.95 J02S.6
  Bottom 0.254: v53.21,39.24 52.58,38.61 JP4.2
EINK_OE  (via drill 0.3)
  Top 0.254: U01M.10 56.56,40.98 53.3,37.72 v53.21,37.72 53.21,24.64 53.34,24.51 53.34,22.61 52.7,21.97 v52.7,21.46 | J02S.7 52.58,7.53 52.58,4.57 v52.45,4.45 52.45,4.57
  Bottom 0.254: v52.7,21.46 52.7,4.7 v52.45,4.45 | v53.21,37.72 53.21,36.58 52.7,36.07 JP4.3
EINK_RL  (via drill 0.3)
  Top 0.254: 76.65,40.01 U01M.37 76.59,40.01 75.44,40.01 75.31,40.13 75.31,41.27 74.68,41.91 v74.68,42.04 | v72.26,2.8 R13D.1 | JP6.1 73.53,19.94 v73.28,19.68
  Bottom 0.254: v74.68,42.04 74.68,32 73.28,30.61 v73.28,19.68 73.28,3.82 v72.26,2.8
EINK_SHR  (via drill 0.3)
  Top 0.254: U01M.11 57.24,40.48 53.98,37.21 v53.98,36.2 53.98,24.89 54.36,24.51 54.36,22.3 R12D.2
  Bottom 0.254: v53.98,36.2 53.98,33.91 53.59,33.53 JP4.4
EINK_SPH  (via drill 0.3)
  Top 0.254: U01M.24 70.67,28.25 69.09,26.67 64.77,26.67 61.34,23.24 61.34,22.61 | 61.34,22.61 61.34,17.27 v57.53,13.46 | J02S.11 53.8,4.11 v54.48,3.43 | JP5.1 61.47,22.73 61.34,22.61
  Bottom 0.254: v57.53,13.46 57.53,4.83 57.78,4.57 57.78,3.56 57.02,2.79 54.61,2.79 54.48,2.92 v54.48,3.43 54.61,3.56
EINK_SPV  (via drill 0.3)
  Top 0.254: J02S.32 60.11,12.1 64.01,16 66.04,16 66.44,16.4 | R11D.2 66.44,16.4 | U01M.38 79.03,40.48 v79.5,40.01 | v75.44,16.89 69.85,16.89 68.96,16 66.83,16 66.44,16.4
  Bottom 0.254: v79.5,40.01 76.83,40.01 76.07,39.24 76.07,17.53 75.95,17.4 | JP6.2 75.95,17.4 | 75.95,17.4 v75.44,16.89
EINK_VBORDER  (via drill 0.3)  (1 unrouted)
  Top 0.254: J02S.34 60.71,11.69 63.75,14.73 R07D.1 | U01M.39 79.8,40.98 80.52,40.26 v80.52,39.62 | v75.44,14.73 70.1,14.73 69.22,13.84 67.06,13.84 66.8,14.1 66.8,14.37 R07D.1 | 66.42,14.72 R07D.1
  Bottom 0.254: v80.52,39.62 80.52,15.49 79.88,14.86 77.72,14.86 77.6,14.73 v75.44,14.73
EINK_VDD  (via drill 0.3)
  Top 0.254: R09D.1 R08D.1 68.2,7.87 68.2,10.16 v69.47,10.16 | R05D.1 69.22,19.18 v69.47,18.92 | J02S.4 51.71,11.54 50.67,12.57 50.16,12.57 v50.04,12.7 50.04,14.99 50.04,17.65 48.9,18.8 48.9,21.59 49.36,22.06 R03D.1 v50.04,23.5 | U01M.62 68.17,42.06 v68.2,42.04
  Top 0.305: C05D.1 50.04,14.99
  Bottom 0.254: v69.47,18.92 v69.47,10.16 69.47,7.75 65.79,4.06 61.98,4.06 59.69,1.78 50.93,1.78 50.04,2.67 v50.04,12.7 | v68.2,42.04 66.8,42.04 TP01M.P$1 v50.04,23.5
FB2
  Top 0.305: U03B.5 29.61,41.07 29.78,40.89 29.78,38.95 C10B.1
  Top 0.406: C10B.1 R15B.1 R16B.2
GND  (via drill 0.3, 0.3 pad 0.61)  (1 unrouted)
  Top 0.254: 29.53,47.54 29.53,46.48 28.77,46.48 28.51,46.22 U03B.7 28.51,44.63 28.45,44.58 | U01S.2 72.19,61.91 71.88,61.59 71.88,61.34 72.14,61.09 72.14,60.42 U01S.12 | U01B.8 34.28,73.96 v33.93,74.31 | U01M.12 63.09,39.98 62.1,38.99 62.1,38.14 C05M.2 C06M.2 | v67.69,49.02 67.69,47.45 U01M.63 | U03B.9 27.51,44.52 27.43,44.45 | U03B.3 28.01,31.18 28.07,31.11 | U01M.18 67.67,35.16 67.44,34.92 | U01M.47 75.46,44.98 75.44,44.96 | U01M.31 74.17,35.05 74.3,34.92 | U01M.60 69.17,52.03 69.22,52.07
  Top 0.305: 29.53,47.54 C09B.1 | J01M.GND 31.24,85.44 31.24,83.82 | C02S.2 69.94,66.38 69.6,66.04
  Top 0.61: U05B.3 U05B.2 | U05B.7 U05B.6 | R03B.2 32.54,68.3 32.51,68.33
  other vias: 33.93,75.11 33.13,74.31 33.13,75.11 32.51,71.12 48.01,80.39 48.01,79.12 48.01,77.85 48.01,76.33 60.33,56.64 48.51,61.85 57.78,57.66 42.8,50.93 43.94,50.93 45.09,50.93 28.96,44.07 27.94,44.07 26.92,44.07 29.21,49.02 29.21,49.91 67.82,31.24 65.66,31.24 65.66,32.26 60.33,39.37 62.1,39.37 79.88,46.99 34.04,37.85 34.04,36.7 26.54,5.59 24.89,5.59 29.08,13.46 32.26,14.73 69.47,5.46 66.42,6.73 65.53,11.3 72.14,34.67 72.14,33.53 48.64,4.83 48.64,5.84 66.04,53.09 67.69,53.09 90.93,81.15 55.12,57.66 39.24,81.41 37.72,79.38 69.72,63.75 72.26,63.75 20.57,69.09 21.84,69.09 23.11,69.09 39.88,89.15 39.88,87.88 39.88,86.61 17.78,72.9 17.78,71.88 17.78,69.85 17.78,70.87 37.85,63.37 37.85,64.39 37.85,62.36 34.8,64.39 34.8,63.37 34.8,62.36 42.8,59.56 42.8,58.55 42.8,57.53 72.14,32.38
  pour Top (isolate 0.305, rank 2): 40.13,90.17 40.13,66.55 0.25,66.55 0.25,90.17
  pour Bottom (isolate 0.305): 0.38,89.79 40.26,89.79 40.26,66.55 0.38,66.55
  pour Bottom (isolate 0.254): 41.53,73.53 44.96,73.53 45.09,83.44 51.69,83.44 51.69,89.92 99.95,89.79 100.08,0.64 0.76,0.64 0.64,64.77 41.53,64.77
  pour Bottom (rank 2, no thermals): 33.78,66.55 35.05,66.55 35.05,64.77 33.78,64.77
  pour Top (isolate 0.254): 0.51,64.9 40.89,64.9 40.89,0.25 0.51,0.25 0.51,64.77
  pour Top (isolate 0.254): 47.88,83.57 47.88,64.26 42.16,64.39 42.29,47.37 42.29,0.13 99.95,0.13 99.95,89.92 51.56,89.79 51.56,83.57
  pour Bottom (rank 2, no thermals): 38.1,66.55 39.37,66.55 39.37,64.77 38.1,64.77
JNTRST
  Top 0.254: U01M.56 71.17,49.84 72.14,50.8 80.26,50.8 82.04,49.02 91.19,49.02 93.85,51.69 93.85,52.32 94.36,52.83 95.66,52.83 JP1.4
JTCK
  Top 0.254: U01M.49 74.67,48.38 74.93,48.64 79.5,48.64 81.28,46.86 94.05,46.86 JP1.7
JTDI
  Top 0.254: U01M.50 74.17,48.77 74.68,49.28 79.88,49.28 81.66,47.5 95.41,47.5 JP1.6
JTDO
  Top 0.254: U01M.55 71.67,47.58 71.63,47.62 71.63,49.15 72.52,50.04 80.01,50.04 81.79,48.26 91.95,48.26 93.98,50.29 95.66,50.29 JP1.5
JTMS  (via drill 0.3)
  Top 0.254: JP1.8 93.14,42.69 D01M.A 93.09,42.64 v93.09,41.53 87.63,41.53 87,42.16 v87,44.96 | U01M.46 77.75,44.48 77.98,44.7 77.98,44.83 78.11,44.96 78.49,44.96 v78.61,45.09
  Bottom 0.254: v78.61,45.09 86.87,45.09 v87,44.96
MCU_RX3  (via drill 0.3)
  Top 0.254: U01M.30 73.67,33.52 74.42,32.77 74.42,29.21 v83.44,29.21
  Bottom 0.254: v83.44,29.21 92.46,29.21 93.98,30.73 95.58,30.73 JP2.4
MCU_SCL
  Top 0.254: U01M.58 70.17,50.87 71.75,52.45 73.53,52.45 73.79,52.7 73.79,61.09 | 73.79,61.09 73.79,61.21 73.66,61.34 73.22,61.34 U01S.14 | R04S.1 75.82,61.34 75.56,61.09 73.79,61.09
  Top 0.406: R04S.1 77.25,62.02 TP18M.P$1
MCU_SDA
  Top 0.254: U01S.13 72.99,58.04 | 72.99,58.04 72.99,53.69 72.64,53.34 71.63,53.34 69.67,51.38 U01M.59 | R03S.1 72.99,58.04
  Top 0.406: R03S.1 71.84,56.55 TP17M.P$1
MCU_TX3  (via drill 0.3)
  Top 0.254: U01M.29 73.17,33 73.66,32.51 73.66,28.19 v83.44,28.19
  Bottom 0.254: v83.44,28.19 95.58,28.19 JP2.5
MCU_USBM  (via drill 0.3)
  Top 0.254: U01M.44 78.02,43.48 v78.36,43.81
  Top 0.305: R07M.1 78.87,51.81 v78.87,51.82
  Bottom 0.254: v78.87,51.82 78.87,47.12 77.6,45.85 77.6,44.7 78.36,43.94 v78.36,43.81
MCU_USBP  (via drill 0.3)
  Top 0.254: U01M.45 v74.89,43.98
  Top 0.305: v76.58,51.82 76.58,52.7 76.96,53.09 78.27,53.09 R06M.1
  Bottom 0.254: 76.58,45.85 76.58,44.48 76.07,43.98 v74.89,43.98
  Bottom 0.305: 76.58,45.85 v76.58,51.82
MCU_VBAT  (via drill 0.3)
  Top 0.254: U01M.1 65.01,45.48
  Top 0.305: 65.01,45.48 63.63,46.86 63.63,50.55 61.47,52.7 50.93,52.7 50.16,53.47 50.16,56.39 v50.04,56.52
  Bottom 0.305: v50.04,56.52 47.5,59.05 47.5,74.55 47.88,74.93 50.67,74.93 51.44,75.69 51.44,77.25 51.44,78.33 J02M.1
MODE_BUT
  Top 0.254: 68.67,54.96 68.67,55.21 69.22,55.75 70.19,55.75 S01M.3
  Top 0.305: U01M.61 68.67,54.96
N$  (via drill 0.3)
  Top 0.254: R08M.1 84.84,54.13 84.84,53.34 84.58,53.08 83.57,53.08 | J01M.D+ 32.51,85.42 v32.51,83.31 | 83.57,53.08 80.09,53.08 R06M.2 | 83.57,53.08 v82.93,53.72
  Bottom 0.254: v32.51,83.31 33.53,82.3 42.42,82.3 45.21,79.5 45.21,58.04 49.02,54.23 77.98,54.23 78.49,53.72 v82.93,53.72
N$1
  Top 0.254: J02S.28 58.93,10.72 58.93,13.97 66.04,21.08 66.06,21.08 R04D.2
N$2
  Top 0.254: 26.88,45.42 U03B.10
  Top 0.305: 22.93,51.18 22.93,51.92 L02B.P$2 | 26.75,45.34 26.96,45.34 U03B.10 | 23.05,45.34 arc90 22.93,45.21 22.93,44.45
  Top 0.813: 23.24,44.09 C07B.1 | 26.75,45.34 23.05,45.34
  Top 1.016: 22.93,51.18 22.93,44.45 22.93,44.03 C07B.1
N$3
  Top 0.61: D04B.C 18.86,43.18
  Top 1.016: 18.86,43.18 D03B.A | C07B.2 19.07,42.33 D04B.C
N$4
  Top 0.305: U01B.12 35.36,75.46 36,76.1 36,76.8 36.4,77.2 38.08,77.2 R08B.2
N$5  (via drill 0.3)
  Top 0.254: R06D.2 v64.64,5.46 | v60.07,5.46 59.82,5.71 59.82,7.53 J02S.31
  Bottom 0.254: v64.64,5.46 v60.07,5.46
N$6
  Top 0.406: U06B.5 30.73,9.31 R18B.2
N$8
  Top 0.254: U03B.6 29.29,45.29 29.34,45.34
  Top 0.61: D05B.A 34.93,45.08 34.67,45.34
  Top 0.813: L03B.P$2 35.35,45.31 D05B.A | 34.67,45.34 29.34,45.34
N$9
  Top 0.254: U01B.16 32.63,76.21 32,76.83 30.23,76.83 29.21,77.85 28.07,77.85 27.81,78.11 27.81,78.7 R09B.2
N$10
  Top 0.254: R02S.2 U01S.8
N$11
  Top 0.254: R04B.1 30.84,70.84 32.78,72.78 U01B.5
N$12
  Top 0.254: U01B.6 33.28,70.18 R03B.1
N$13
  Top 0.254: U01B.14 33.78,77.22 32.64,78.36 32.64,78.66 R06B.2
N$14
  Top 0.305: R01M.2 83.57,45.03 D02M.RED
N$15
  Top 0.254: U01B.1 31.85,75.46 31.24,76.07 29.46,76.07 28.96,76.58 28.27,76.58 R10B.2
N$17
  Top 0.254: D02B.A 39.34,71.42 R02B.1
N$18
  Top 0.254: D01B.A 39.4,67.99 R01B.2
N$19
  Top 0.406: 19.28,85.95 U1.5 19.22,85.94 R21B.2
N$21
  Top 0.254: U02B.1 54.29,63.31 53.47,64.14 51.69,64.14 50.88,63.32 R11B.1
  Top 0.406: R11B.1 50.38,63.32 TP01B.P$1
N$22
  Top 0.305: Q02M.2 Q02M.3 84.92,59.36 84.92,61.48 | R09M.2 84.92,61.48 | 84.92,61.48 R12M.1
N$23
  Top 0.254: L01B.1 59.52,65.36 59.56,65.41
  Top 0.305: 55.39,65.36 55.24,65.36 U02B.3
  Top 0.813: 55.39,65.36 55.05,65.41 59.56,65.41 59.69,65.41
N$24
  Top 0.254: R13D.2 61.21,2.8 59.2,4.81 J02S.29
N$25
  Top 0.813: Q02B.3 31.42,50.62 32.13,49.91 L03B.P$1
N$26
  Top 0.254: J02S.35 61,8.55 61.34,8.89 64.52,8.89 65.53,7.87 R08D.2
N$27
  Top 0.254: J02S.36 61.31,9.81 61.47,9.65 65.15,9.65 65.66,10.16 R09D.2
N$28
  Top 0.254: J02S.9 53.2,3.92
  Top 0.305: 53.2,3.92 52.32,3.05 49.82,3.05 R02D.1
N$29
  Top 0.305: J02S.20 56.51,11.93 U$1.P$1
N$30
  Top 0.254: U1.1 19.21,83.28 | 23.83,84.58 D06B.C
  Top 0.406: 19.21,83.35 U1.1 | 19.21,83.28 19.21,84.33 19.47,84.58 23.83,84.58
N$31
  Top 0.305: J02S.26 58.31,11.92 U$8.P$1
N$32
  Top 0.254: 54.24,20.33 R12D.1 54.33,20.45 53.34,20.45 52.91,20.02 J02S.8
N$33
  Top 0.305: J02S.39 62.2,6.63 U$9.P$1
N$35
  Top 0.254: Q02M.5 81.41,58.67 80.77,59.31 80.77,60.15 R10M.2
N$36  (1 unrouted)
  Top 0.254: 21.02,7.54 R17B.1
  Top 0.406: 21.15,7.05 R17B.1 21.13,7.38 21.13,5.71 22.23,5.71 23.37,4.57 31.75,4.57 32,4.83 32,5.87 R18B.3
N$37
  Top 0.406: D06B.A 25.54,82.69 R20B.2
N$38
  Top 0.254: D01M.C 91.39,44.42 R05M.1
N$100  (via drill 0.3)
  Top 0.254: R07M.2 84.58,51.81 v84.71,51.94 | v34.16,83.31 33.91,83.31 33.15,84.07 33.15,85.4 J01M.D-
  Bottom 0.254: v84.71,51.94 84.71,54.74 84.33,55.12 49.53,55.12 46.23,58.42 46.23,80.52 43.81,82.93 34.54,82.93 v34.16,83.31
NEG_EN  (via drill 0.3)
  Top 0.254: v30.73,43.31 27.81,43.31 27.51,43 U03B.2 27.51,31.8 R23B.1 | U01M.53 72.67,46 72.14,45.47 70.74,45.47 v70.36,45.09
  Bottom 0.254: v30.73,43.31 30.99,43.31 32.26,42.04 34.67,42.04 37.34,44.7 69.98,44.7 v70.36,45.09
NFB1
  Top 0.305: U03B.1 26.91,41.07 26.23,40.39 26.23,39.2 C08B.1 R13B.1 R14B.2
OSC32_IN
  Top 0.254: C01M.1 59.85,50.62 Y01M.X2 60.18,50.29 60.45,50.29 60.45,50.04 62.23,48.26 62.23,45.97 63.73,44.48 U01M.3
OSC32_OUT
  Top 0.254: U01M.4 63.21,43.98 61.47,45.72 61.47,46.74 60.45,47.75 60.22,47.75 Y01M.X1 59.85,48.08 C02M.1
OSC_IN
  Top 0.254: 59.91,45.51 Y02M.3 | U01M.5 62.7,43.48 60.96,45.21 60.02,45.21 Y02M.3 | Y02M.3 58.37,45.42 57.4,44.45 54.1,44.45 53.59,44.96 53.59,45.42 C03M.1
OSC_OUT
  Top 0.254: U01M.6 61.92,42.98 61.47,43.43 61.47,43.69 60.96,44.2 58.42,44.2 57.66,43.43 56.9,43.43 56.58,43.12 Y02M.1 53.59,43.12 C04M.1
POS_CTRL  (2 unrouted)
  Top 0.254: U01M.2 64.24,44.98 62.99,46.23 62.99,49.4 61.72,50.67 61.72,51.31 61.09,51.94 41.02,51.94 41.02,54.1 40.39,54.74 38.1,54.74 | R25B.1 38.01,54.64
  Top 0.813: R25B.1 33.49,54.64 Q02B.1
POS_EN  (via drill 0.3)
  Top 0.254: v30.73,42.16 28.7,42.16 28.51,41.97 U03B.4 28.51,31.79 R24B.1 | U01M.52 73.17,45.23 72.01,44.07 v71.25,44.07
  Bottom 0.254: v71.25,44.07 37.47,44.07 34.67,41.27 31.62,41.27 v30.73,42.16
R01S
  Top 0.61: R01S.1 78.77,77.91 D01S.A
R02M
  Top 0.305: D02M.GREEN 82.43,42.76 R02M.2
R03M
  Top 0.254: R03M.2 84.78,40.84 85.34,41.4 85.34,42.66 D02M.BLUE
RGB_BLUE
  Top 0.254: U01M.41 80.83,41.98 81.66,41.15 83.22,41.15 R03M.1
RGB_GREEN
  Top 0.254: R02M.1 76.64,43 U01M.43
RGB_RED  (via drill 0.3)
  Top 0.254: v79.38,43.81 79.38,44.83 79.63,45.09 80.43,45.09 R01M.1 | U01M.42 75.51,42.48 v74.93,43.05
  Bottom 0.254: v79.38,43.81 79.38,43.18 79.12,42.93 75.06,42.93 v74.93,43.05
SD_CD
  Top 0.254: U$5.P$1 92.34,73.28 J01S.CD1
SD_CS  (via drill 0.3)
  Top 0.254: J01S.2 86.35,81.8 88.14,80.01 88.14,76.07 | 88.14,76.07 88.14,50.67 TP05M.P$1 | D01S.C 88.11,76.1 88.14,76.07 | U01M.33 76.62,37.04 76.83,36.83 87.5,36.83 87.76,37.08 v87.76,37.85
  Bottom 0.254: TP05M.P$1 88.39,38.48 v87.76,37.85
SMPS_CTRL  (via drill 0.3)  (1 unrouted)
  Top 0.254: U01M.51 73.67,48.63 v73.15,49.15 | TP1.P$1 32.24,58.93 R12B.1
  Top 0.305: v40.39,58.93 38.23,58.93 | 32.37,58.79 arc-90 R12B.1
  Top 0.813: R12B.1 30.25,58.97 Q01B.1
  Bottom 0.254: 73.66,47.62 73.66,48.64 v73.15,49.15 72.26,49.15 70.61,47.5 41.78,47.5 40.26,49.02 40.26,58.8 v40.39,58.93
SPI_MISO  (via drill 0.3)
  Top 0.254: J01S.7 91.85,80.67 90.42,79.25 | 90.42,54.23 TP03M.P$1 | 91.05,38.98 v91.19,39.12 90.93,38.86 85.85,38.86 85.09,38.1 78.49,38.1 78.36,38.23 78.36,38.61 77.99,38.98 U01M.35 | 90.42,79.25 90.42,54.23 | 90.42,79.25 90.42,54.23
  Bottom 0.254: TP03M.P$1 90.93,39.37 v91.19,39.12
SPI_MOSI  (via drill 0.3)
  Top 0.254: J01S.3 87.45,82.35 88.9,80.9 88.9,51.82 TP02M.P$1 | v89.15,39.88 88.77,39.5 85.6,39.5 84.84,38.73 79.12,38.73 78.36,39.5 76.64,39.5 U01M.36
  Bottom 0.254: TP02M.P$1 89.15,50.93 89.41,50.67 89.41,49.66 89.28,49.53 89.28,40.01 v89.15,39.88
SPI_SCK  (via drill 0.3)
  Top 0.254: 89.65,69.85 J01S.5 89.65,81.67 v89.66,81.66 | 89.65,69.85 89.65,69.35 89.66,69.34 | 89.66,52.96 TP04M.P$1 | R01S.2 78.77,82.27 v78.74,82.3 | U01M.34 77.6,38.48 77.72,38.35 77.72,37.72 77.98,37.47 85.72,37.47 v86.11,37.85 | 89.65,52.97 89.66,52.96 | 89.66,52.96 89.66,69.84 89.65,69.85
  Bottom 0.254: v78.74,82.3 89.03,82.3 v89.66,81.66 | v86.11,37.85 86.23,37.85 87.25,36.83 88.77,36.83 90.04,38.1 90.04,49.4 90.17,49.53 90.17,52.45 TP04M.P$1
U1CE2
  Top 0.254: J02S.30 59.51,13.54 65.15,19.18 R05D.2
U2CKV
  Top 0.254: J02S.38 63.53,10.7 65.15,12.32 R10D.1
U2SPV  (via drill 0.3)
  Top 0.254: R11D.1 68.14,17.59 67.82,17.91 65.53,17.91 65.28,17.65 v65.28,17.02
  Top 0.305: J02S.37 61.6,5.2 61.72,5.08 63.5,5.08 63.75,5.33 63.75,6.1 64.14,6.1 v64.64,6.6
  Bottom 0.254: v64.64,6.6 64.64,15.37 65.28,16 v65.28,17.02
USB_DISC  (1 unrouted)
  Top 0.254: R11M.2 80.78,55.69 Q2.1 78.3,55.69 77.98,56.01 77.98,58.04 | 78.89,60.2 78.23,60.2 77.98,59.94 77.98,58.04 | 76.33,58.04 76.2,58.04 75.18,57.02 75.18,52.32 74.42,51.56 71.88,51.56 70.67,50.35 U01M.57 | 76.33,58.04 77.98,58.04 | TP06M.P$1 76.2,58.17 76.33,58.04
VBUS  (via drill 0.8 pad 1.68)
  Top 0.254: 21.24,85.69 21.24,85.82 U1.4
  Top 0.305: 25.65,84.84 25.65,84.51 R20B.1
  Top 0.406: 21.24,85.69 24.8,85.69 25.65,84.84 | U1.4 21.18,86.71 21.34,86.87 C19B.2
  Top 1.016: v28.19,82.8 28.19,83.06 26.8,84.45 25.6,84.45 R20B.1
  Bottom 0.254: 35.18,80.77 35.22,80.77 J01B.1
  Bottom 0.813: 35.18,80.77 30.1,80.77 30.1,80.9 v28.19,82.8
  pour Top (isolate 0.254): 34.3,77 34.9,77 34.9,78 37.8,80.9 37.8,85.7 33.8,85.7 33.8,78 34.3,77.5
  pour Top (no thermals): 34.9,77.15 34.9,75.95 34.3,75.95 34.3,77.15
VCOM
  Top 0.254: C17B.2 33,11.72 J11B.1
  Top 0.305: J02S.22 57.11,9.61 56.9,9.4 37.02,9.4 J11B.1
  Top 0.406: C17B.2 30.29,11.05 29.86,10.61 U06B.7 U06B.6
VDDA
  Top 0.254: C05M.1 C06M.1
VIN  (1 unrouted)
  Top 0.254: U03B.8 28.01,47.71 C09B.2 | Q01B.3 28.05,56.91 28.45,56.52
  Top 0.61: Q02B.2 35.59,56.44 R25B.2
  Top 0.813: 33.53,56.52 28.45,56.52 | 28.05,52.07 Q01B.3 J06B.1 | 28.05,52.07 C09B.2 | L02B.P$1 27.92,51.94 28.05,52.07

## Text on the board
tNames: +5V | VIN | + | BM_OUT | - | CD | CHG | PWR | Designed in Singapore 07/15 / Eink display v0.2.0 / Apache License 2.0 / @kennethlimcp | RESET | MRST | +3V3 | MODE | GND | 3V3 | SPI | JRST | TDO | TDI | JTAG | TCK | CL | TMS | LE | OE | SHR | D0 | FTDI | D1 | -20V | +22V | D3 | D6 | D2 | D7 | E_VDD | SPH | GND / NIL / +3V3 / MCU_RX / MCU_TX | GND / NIL / +3V3 / MCU_RX / MCU_TX | D4 | D5 | RL | SPV | GMODE | +15V | -15V | VBORD | CKV | VCOM | SG / 50
bNames: SG / 50
bValues: G | G